# Altium project USB_Rec.PrjPcb
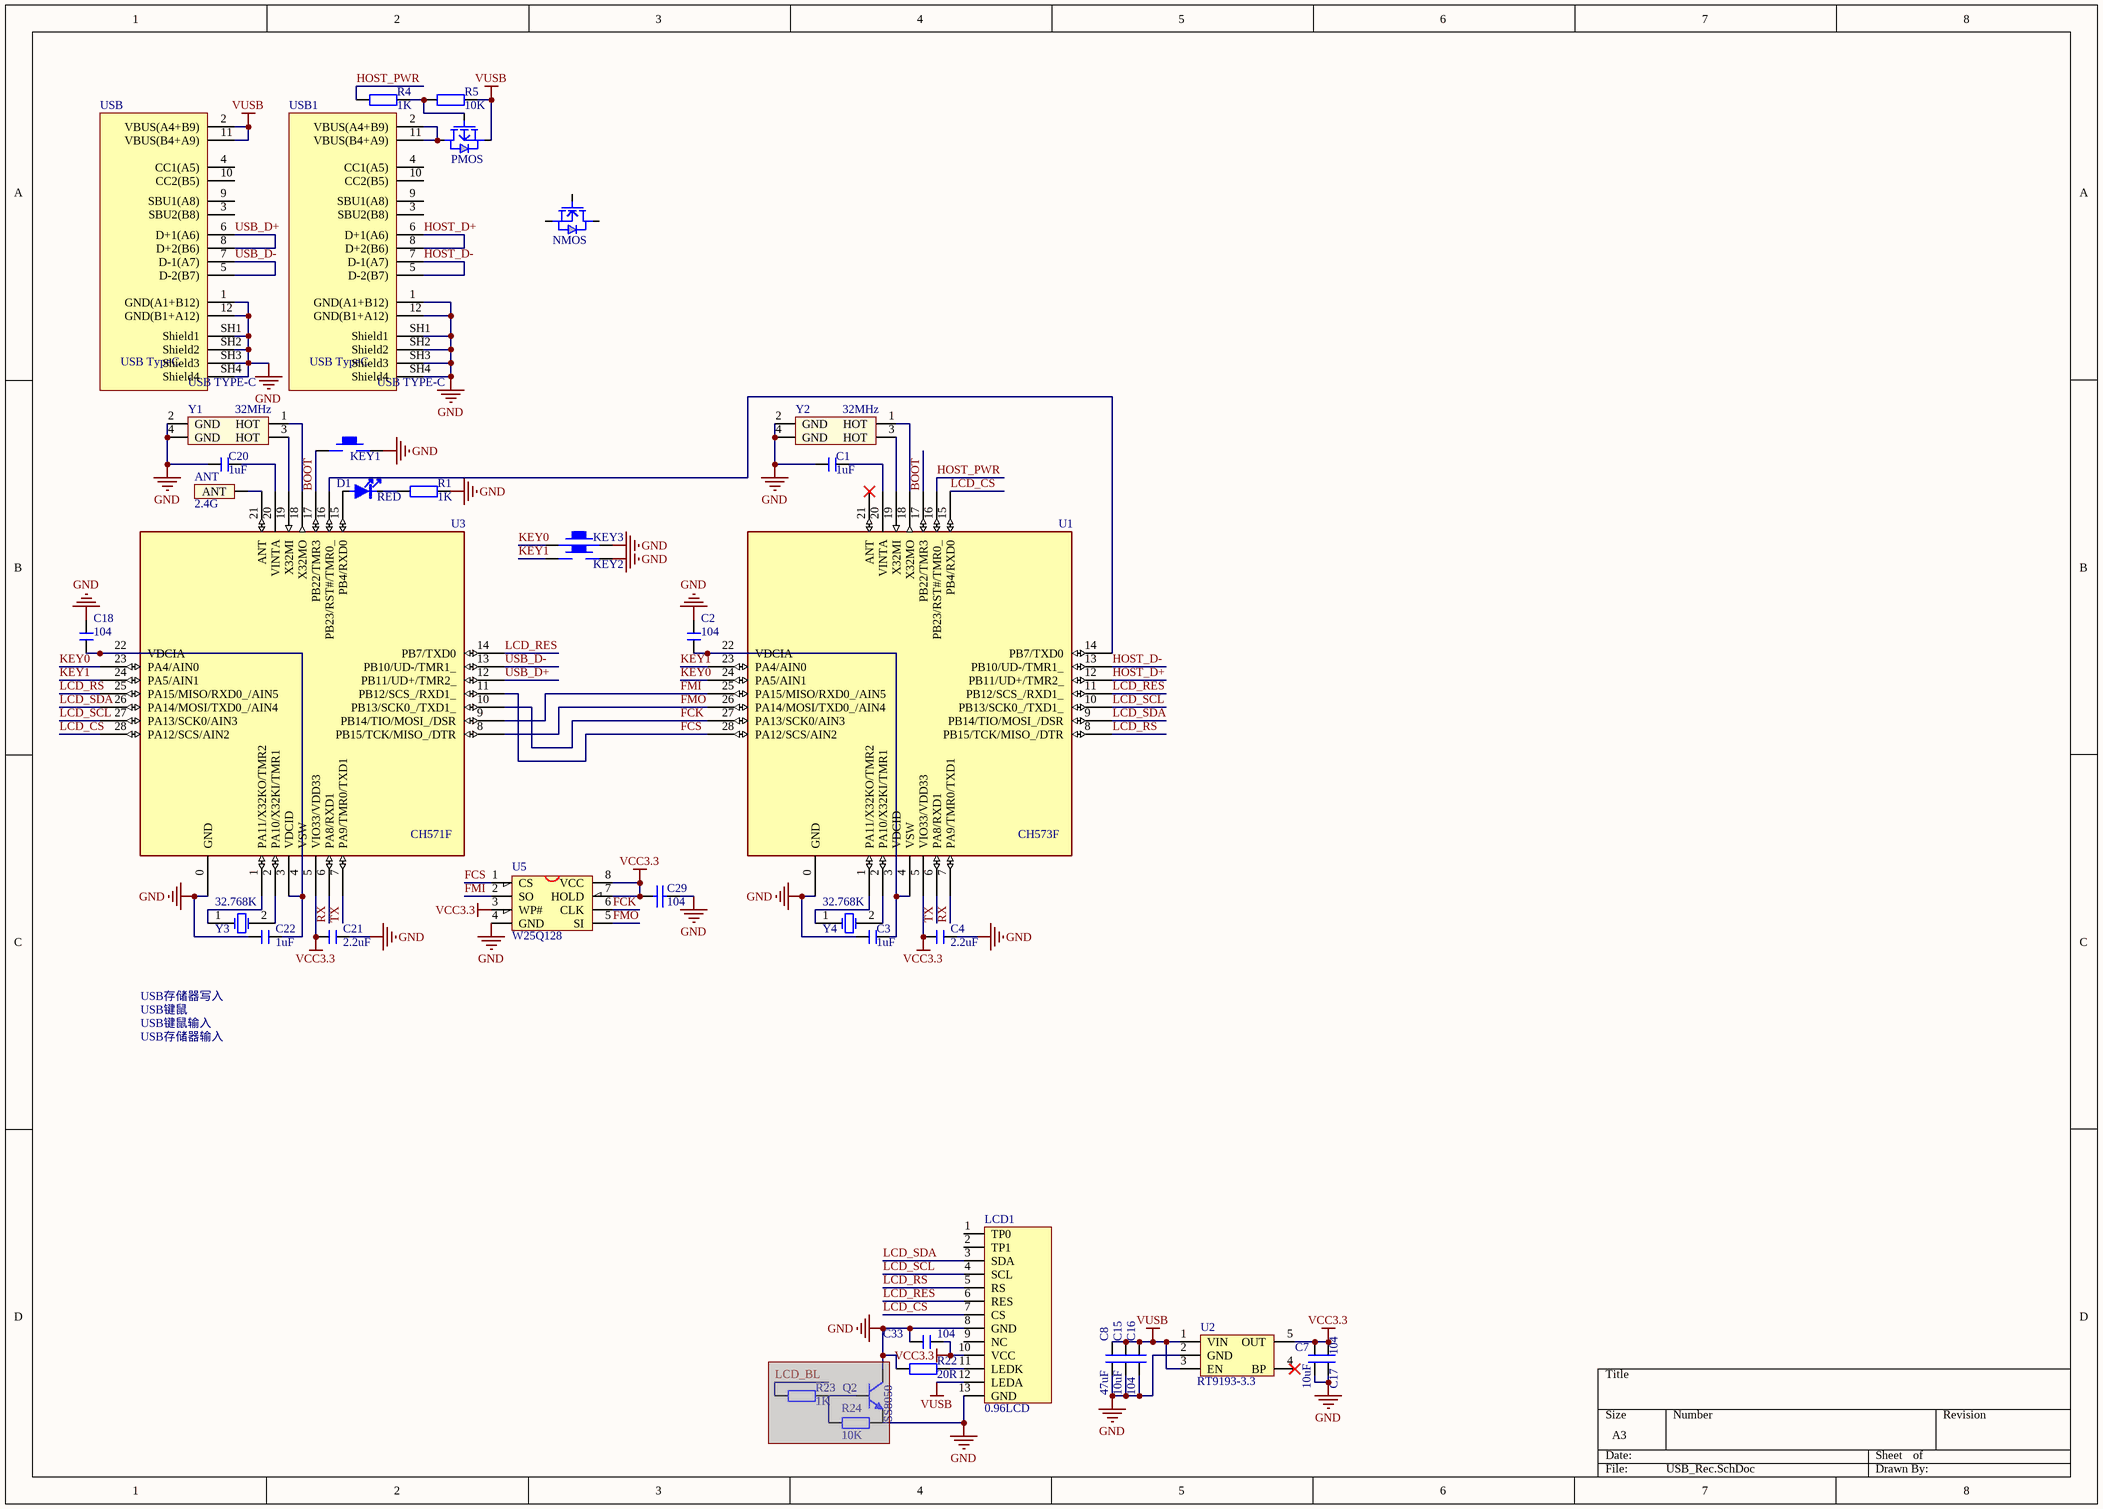
[diagram p0: USB_Rec.SchDoc]
1 sheet, 40 parts. Net scope: global (net labels, ports and power ports of the same name join across sheets).
Board file: USB_Rec.PcbDoc

## Sheet USB_Rec.SchDoc
size A3

### Parts
ANT  2.4G  [2.4GANTS8]
C1  1uF  [C 0603_L]
C2  104  [C 0603_L]
C3  1uF  [C 0603_L]
C4  2.2uF  [C 0603_L]
C7  10uF  [C 0603_L]
C8  47uF  [C 0603_L]
C15  10uF  [C 0603_L]
C16  104  [C 0603_L]
C17  104  [C 0603_L]
C18  104  [C 0603_L]
C20  1uF  [C 0603_L]
C21  2.2uF  [C 0603_L]
C22  1uF  [C 0603_L]
C29  104  [C 0603_L]
C33  104  [C 0603_L]
D1  RED  [LED 0603B]
KEY1  KEY-SMD  [TSW SMD-3*6*2.5]  (value not drawn)
KEY2  KEY-SMD  [TSW SMD-3*6*2.5]  (value not drawn)
KEY3  KEY-SMD  [TSW SMD-3*6*2.5]  (value not drawn)
LCD1  0.96LCD  [LCD 0.96 13P]
NMOS  SI2302  [SOT23-3L]  (value not drawn)
PMOS  SI2301  [SOT23-3L]  (value not drawn)
Q2  SS8050  [SOT23-3L]  (masked out: inside a compile mask, not in the netlist)
R1  1K  [R 0603_L]
R4  1K  [R 0603_L]
R5  10K  [R 0603_L]
R22  20R  [R 0603_L]
R23  1K  [R 0603_L]  (masked out: inside a compile mask, not in the netlist)
R24  10K  [R 0603_L]  (masked out: inside a compile mask, not in the netlist)
U1  CH573F  [QFN28_4X4]
U2  RT9193-3.3  [SOT23-5L]
U3  CH571F  [QFN28_4X4]
U5  W25Q128  [SOP8W_L]
USB  USB TypeC  [USB Type-C]
USB1  USB TypeC  [USB Type-C]
Y1  32MHz  [OSC 3225-4P]
Y2  32MHz  [OSC 3225-4P]
Y3  32.768K  [OSC 3215-2P]
Y4  32.768K  [OSC 3215-2P]

### Nets
GND: C1.2 C2.2 C3.2 C4.2 C7.2 C8.2 C15.2 C16.2 C17.2 C18.2 C20.2 C21.2 C22.2 C29.1 C33.2 KEY1.1 KEY2.1 KEY3.1 LCD1.8(GND) LCD1.13(GND) R1.1 R22.1 U1.0(GND) U2.2(GND) U3.0(GND) U5.4(GND) USB.1(GND(A1+B12)) USB.12(GND(B1+A12)) USB.SH1(Shield1) USB.SH2(Shield2) USB.SH3(Shield3) USB.SH4(Shield4) USB1.1(GND(A1+B12)) USB1.12(GND(B1+A12)) USB1.SH1(Shield1) USB1.SH2(Shield2) USB1.SH3(Shield3) USB1.SH4(Shield4) Y1.2(GND) Y1.4(GND) Y2.2(GND) Y2.4(GND)
VCC3.3: C4.1 C7.1 C17.1 C21.1 C29.2 C33.1 LCD1.10(VCC) U1.5(VIO33/VDD33) U2.5(OUT) U3.5(VIO33/VDD33) U5.3(WP#) U5.7(HOLD) U5.8(VCC)
VUSB: C8.1 C15.1 C16.1 LCD1.12(LEDA) PMOS.2(S) R5.1 U2.1(VIN) U2.3(EN) USB.2(VBUS(A4+B9)) USB.11(VBUS(B4+A9))
BOOT: KEY1.2 U1.17(PB22/TMR3) U3.17(PB22/TMR3)
FCK: U1.27(PA13/SCK0/AIN3) U3.10(PB13/SCK0_/TXD1_) U5.6(CLK)
FCS: U1.28(PA12/SCS/AIN2) U3.11(PB12/SCS_/RXD1_) U5.1(CS)
FMI: U1.25(PA15/MISO/RXD0_/AIN5) U3.9(PB14/TIO/MOSI_/DSR) U5.2(SO)
FMO: U1.26(PA14/MOSI/TXD0_/AIN4) U3.8(PB15/TCK/MISO_/DTR) U5.5(SI)
HOST_D+: U1.12(PB11/UD+/TMR2_) USB1.6(D+1(A6)) USB1.8(D+2(B6))
HOST_D-: U1.13(PB10/UD-/TMR1_) USB1.5(D-2(B7)) USB1.7(D-1(A7))
HOST_PWR: R4.2 U1.16(PB23/RST#/TMR0_)
KEY0: KEY3.2 U1.24(PA5/AIN1) U3.23(PA4/AIN0)
KEY1: KEY2.2 U1.23(PA4/AIN0) U3.24(PA5/AIN1)
LCD_CS: LCD1.7(CS) U1.15(PB4/RXD0) U3.28(PA12/SCS/AIN2)
LCD_RES: LCD1.6(RES) U1.11(PB12/SCS_/RXD1_) U3.14(PB7/TXD0)
LCD_RS: LCD1.5(RS) U1.8(PB15/TCK/MISO_/DTR) U3.25(PA15/MISO/RXD0_/AIN5)
LCD_SCL: LCD1.4(SCL) U1.10(PB13/SCK0_/TXD1_) U3.27(PA13/SCK0/AIN3)
LCD_SDA: LCD1.3(SDA) U1.9(PB14/TIO/MOSI_/DSR) U3.26(PA14/MOSI/TXD0_/AIN4)
RX: U1.7(PA9/TMR0/TXD1) U3.6(PA8/RXD1)
TX: U1.6(PA8/RXD1) U3.7(PA9/TMR0/TXD1)
USB_D+: U3.12(PB11/UD+/TMR2_) USB.6(D+1(A6)) USB.8(D+2(B6))
USB_D-: U3.13(PB10/UD-/TMR1_) USB.5(D-2(B7)) USB.7(D-1(A7))
NetANT_1: ANT.1(ANT) U3.21(ANT)
NetC1_1: C1.1 U1.20(VINTA)
NetC2_1: C2.1 C3.1 U1.3(VDCID) U1.4(VSW) U1.22(VDCIA)
NetC18_1: C18.1 C22.1 U3.3(VDCID) U3.4(VSW) U3.22(VDCIA)
NetC20_1: C20.1 U3.20(VINTA)
NetD1_1: D1.1 U3.15(PB4/RXD0)
NetD1_2: D1.2 R1.2
NetLCD1_11: LCD1.11(LEDK) R22.2
NetPMOS_1: PMOS.1(G) R4.1 R5.2
NetPMOS_3: PMOS.3(D) USB1.2(VBUS(A4+B9)) USB1.11(VBUS(B4+A9))
NetU1_1: U1.1(PA11/X32KO/TMR2) Y4.1(OSC1)
NetU1_2: U1.2(PA10/X32KI/TMR1) Y4.2(OSC2)
NetU1_14: U1.14(PB7/TXD0) U3.16(PB23/RST#/TMR0_)
NetU1_18: U1.18(X32MO) Y2.1(HOT)
NetU1_19: U1.19(X32MI) Y2.3(HOT)
NetU3_1: U3.1(PA11/X32KO/TMR2) Y3.1(OSC1)
NetU3_2: U3.2(PA10/X32KI/TMR1) Y3.2(OSC2)
NetU3_18: U3.18(X32MO) Y1.1(HOT)
NetU3_19: U3.19(X32MI) Y1.3(HOT)

Not connected (* = marked no-connect by the designer): LCD1 1(TP0) 2(TP1) 9(NC); NMOS 1(G) 2(S) 3(D); U1 21(ANT)*; U2 4(BP)*; USB 3(SBU2(B8)) 4(CC1(A5)) 9(SBU1(A8)) 10(CC2(B5)); USB1 3(SBU2(B8)) 4(CC1(A5)) 9(SBU1(A8)) 10(CC2(B5))

### Notes on the sheet
- USB存储器写入
- USB键鼠
- USB键鼠输入
- USB存储器输入
- (in symbol USB 2.0 Type C) USB TYPE-C

### Library data of the parts
ANT = ANT: 2.4G天线
C1-C4 C7 C8 C15-C18 C20-C22 = C: 无极性贴片电容
C29 = CAP
C33 = C: 无极性电容
D1 = LED: 发光二极管
KEY1-KEY3 = S-KEY-SMD-324225: KEY,SMD,324225
LCD1 = LCD 0.96: 0.96 LCD 80*160
NMOS = NMOS: SOT-23
PMOS = PMOS: SOT-23
Q2 = 8050-SMD: 高频放大-NPN型
R1 R4 R5 R22-R24 = R: 贴片电阻
U1 U3 = CH571F: RISC-V MCU with BLE/USB/ADC/SPI/2*UART
U2 = LDO RT9193: LDO
U5 = W25X16: W25X16;SST25VF016;MX25L1605
USB USB1 = USB 2.0 Type C: 12P TypeC 母座
Y1 Y2 = Y-3225-4P: 晶振25MHz; Published: 8-Jun-2000; LatestRevisionDate: 17-Jul-2002; LatestRevisionNote: Re-released for DXP Platform.; Publisher: Altium Limited
Y3 Y4 = Y-3215-2P: 晶振32.768K